# Altium schematic sheet 14_I2C_Sensor_OnBoard.SchDoc
size 420 x 297 mm; SheetNumber: 14; SheetTotal: 27
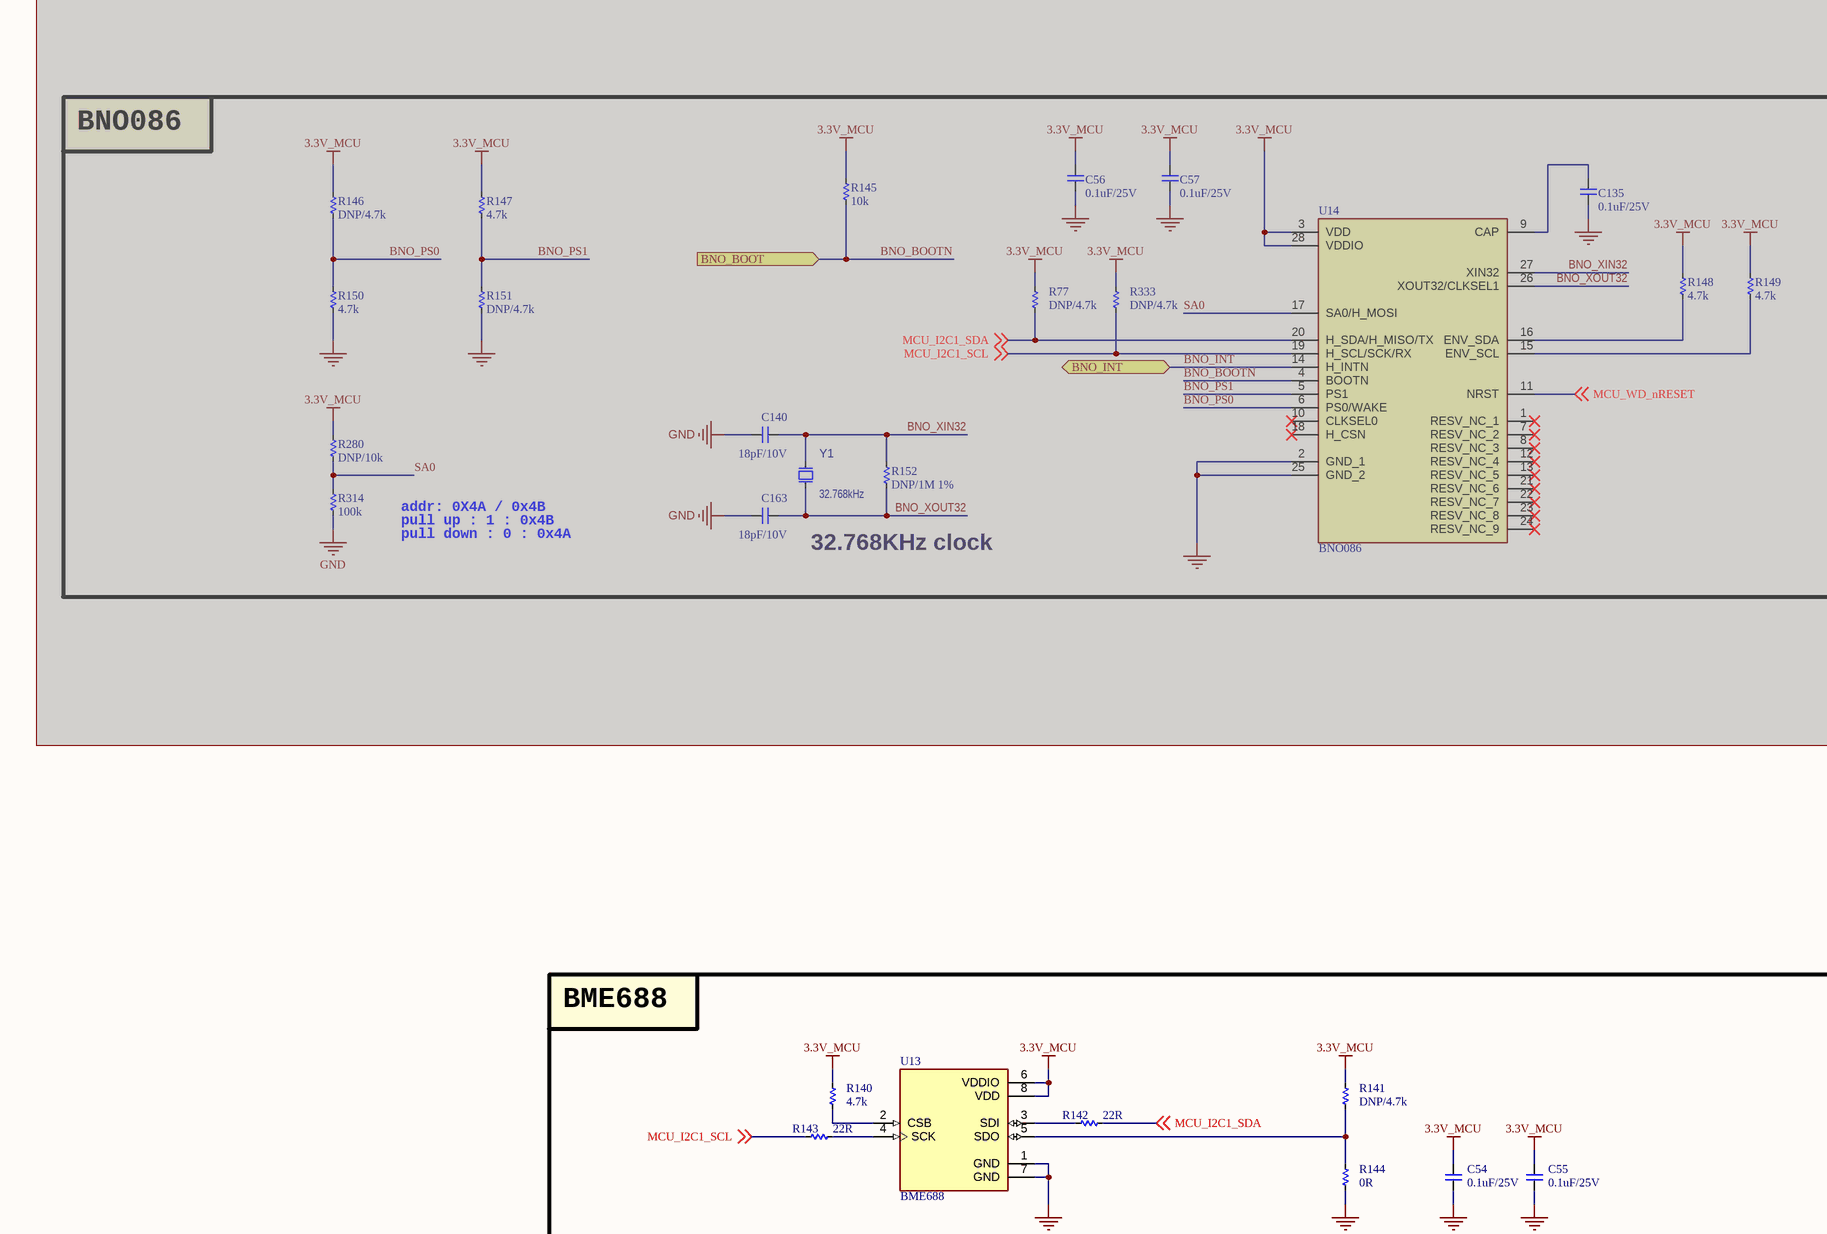
[diagram p0: 14_I2C_Sensor_OnBoard.SchDoc, top left]
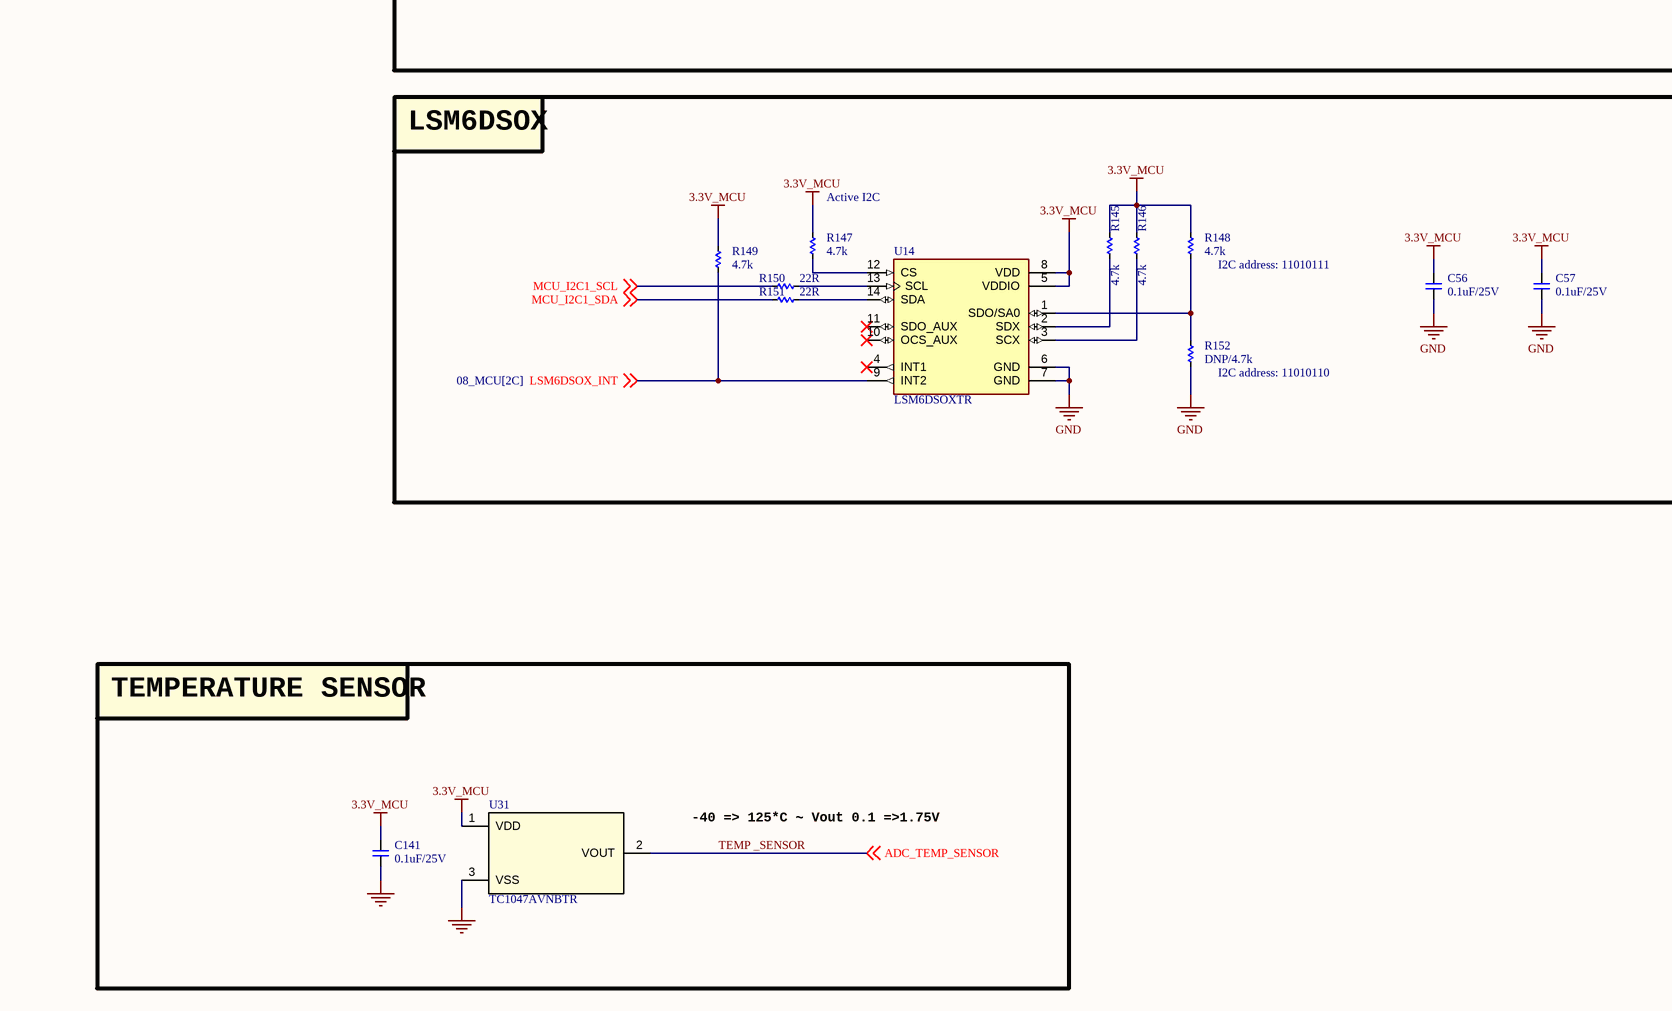
[diagram p1: 14_I2C_Sensor_OnBoard.SchDoc, bottom left]

## Parts
(Parts that share a designator on the sheet are numbered #1, #2 ... from top to bottom, then left to right.)
C54  0.1uF/25V  [CAP_C_1005X60]
C55  0.1uF/25V  [CAP_C_1005X60]
C56#1  0.1uF/25V  [CAP_C_1005X60]  (masked out: inside a compile mask, not in the netlist)
C56#2  0.1uF/25V  [CAP_C_1005X60]
C57#1  0.1uF/25V  [CAP_C_1005X60]  (masked out: inside a compile mask, not in the netlist)
C57#2  0.1uF/25V  [CAP_C_1005X60]
C135  0.1uF/25V  [CAP_C_1005X60]  (masked out: inside a compile mask, not in the netlist)
C140  18pF/10V  [CAP_C_1005X60]  (masked out: inside a compile mask, not in the netlist)
C141  0.1uF/25V  [CAP_C_1005X60]
C163  18pF/10V  [CAP_C_1005X60]  (masked out: inside a compile mask, not in the netlist)
R77  DNP/4.7k  [RES_C_1005X40]  (masked out: inside a compile mask, not in the netlist)
R140  4.7k  [RES_C_1005X40]
R141  DNP/4.7k  [RES_C_1005X40]
R142  22R  [RES_C_1005X40]
R143  22R  [RES_C_1005X40]
R144  0R  [RES_C_1005X40]
R145#1  10k  [RES_C_1005X40]  (masked out: inside a compile mask, not in the netlist)
R145#2  4.7k  [RES_C_1005X40]
R146#1  DNP/4.7k  [RES_C_1005X40]  (masked out: inside a compile mask, not in the netlist)
R146#2  4.7k  [RES_C_1005X40]
R147#1  4.7k  [RES_C_1005X40]  (masked out: inside a compile mask, not in the netlist)
R147#2  4.7k  [RES_C_1005X40]
R148#1  4.7k  [RES_C_1005X40]  (masked out: inside a compile mask, not in the netlist)
R148#2  4.7k  [RES_C_1005X40]
R149#1  4.7k  [RES_C_1005X40]  (masked out: inside a compile mask, not in the netlist)
R149#2  4.7k  [RES_C_1005X40]
R150#1  4.7k  [RES_C_1005X40]  (masked out: inside a compile mask, not in the netlist)
R150#2  22R  [RES_C_1005X40]
R151#1  DNP/4.7k  [RES_C_1005X40]  (masked out: inside a compile mask, not in the netlist)
R151#2  22R  [RES_C_1005X40]
R152#1  DNP/1M 1%  [RES_C_1005X40]  (masked out: inside a compile mask, not in the netlist)
R152#2  DNP/4.7k  [RES_C_1005X40]
R280  DNP/10k  [RES_C_1005X40]  (masked out: inside a compile mask, not in the netlist)
R314  100k  [RES_C_1005X40]  (masked out: inside a compile mask, not in the netlist)
R333  DNP/4.7k  [RES_C_1005X40]  (masked out: inside a compile mask, not in the netlist)
U13  BME688  [IC_BME688]
U14#1  BNO086  [BNO086]  (masked out: inside a compile mask, not in the netlist)
U14#2  LSM6DSOXTR  [PQFN50P250X300X86-14N]
U31  TC1047AVNBTR  [SOT95P240X120-3N]
Y1  value 32.768kHz  [CRYSTAL_NX2012SA]  (hidden comment: Crystal 2 Pins)  (masked out: inside a compile mask, not in the netlist)

## Blocks framed on the sheet
BNO086: C56#1 C57#1 C135 C140 C163 R77 R145#1 R146#1 R147#1 R148#1 R149#1 R150#1 R151#1 R152#1 R280 R314 R333 U14#1 Y1
BME688: C54 C55 R140-R144 U13
LSM6DSOX: C56#2 C57#2 R145#2 R146#2 R147#2 R148#2 R149#2 R150#2 R151#2 R152#2 U14#2
TEMPERATURE SENSOR: C141 U31

## Ports
BNO_BOOT (in), BNO_INT (bidir)

## Nets
3.3V_MCU: C54.2 C55.2 C56#2.2 C57#2.2 C141.2 R140.1 R141.1 R145#2.1 R146#2.1 R147#2.1 R148#2.1 R149#2.1 U13.6(VDDIO) U13.8(VDD) U14#2.5(VDDIO) U14#2.8(VDD) U31.1(VDD)
GND: C54.1 C55.1 C56#2.1 C57#2.1 C141.1 R144.2 R152#2.2 U13.1(GND) U13.7(GND) U14#2.6(GND) U14#2.7(GND) U31.3(VSS)
LSM6DSOX_INT: R149#2.2 U14#2.9(INT2) ; off-sheet LSM6DSOX_INT
MCU_I2C1_SCL: R143.1 R150#2.1 ; off-sheet MCU_I2C1_SCL
MCU_I2C1_SDA: R142.2 R151#2.1 ; off-sheet MCU_I2C1_SDA
TEMP _SENSOR: U31.2(VOUT) ; off-sheet ADC_TEMP_SENSOR  [also labelled ADC_TEMP_SENSOR]
NetR140_2: R140.2 U13.2(CSB)
NetR141_2: R141.2 R144.1 U13.5(SDO)
NetR142_1: R142.1 U13.3(SDI)
NetR143_2: R143.2 U13.4(SCK)
NetR145#2_2: R145#2.2 U14#2.2(SDX)
NetR146#2_2: R146#2.2 U14#2.3(SCX)
NetR147#2_2: R147#2.2 U14#2.12(CS)
NetR148#2_2: R148#2.2 R152#2.1 U14#2.1(SDO/SA0)
NetR150#2_2: R150#2.2 U14#2.13(SCL)
NetR151#2_2: R151#2.2 U14#2.14(SDA)

Not connected (* = marked no-connect by the designer): U14#2 4(INT1)* 10(OCS_AUX)* 11(SDO_AUX)*

## Notes on the sheet
- addr: 0X4A / 0x4B
- pull up : 1 : 0x4B
- pull down : 0 : 0x4A
- 32.768KHz clock
- (near R147#2) Active I2C
- (near R148#2) I2C address: 11010111
- (near R152#2) I2C address: 11010110
- -40 => 125*C ~ Vout 0.1 =>1.75V
- Project
- Sub-system:
- Design by:
- Sheet title:
- Sheet:
- of
- Checked by:
- Approved by:
- Doc no:
- Revision
- Size:
- Date:

## Library data of the parts
C54 C55 C56#1 C56#2 C57#1 C57#2 C135 C140 C141 C163 = _CAP_C_2: CAP
R77 R140-R144 R145#1 R145#2 R146#1 R146#2 R147#1 R147#2 R148#1 R148#2 R149#1 R149#2 R150#1 R150#2 R151#1 R151#2 R152#1 R152#2 R280 R314 R333 = _RES_B_2: RES
U13 = BME688: Gas sensor measuring relative humidity, barometric pressure, ambient temperature and gas (VOC); Package: None; MP: BME688; Price: None; Availability: Unavailable; Value: *
U14#1 = BNO086: Accelerometer, Gyroscope, Magnetometer, Temperature, 9 Axis Sensor IC, SPI Output; Manufacturer_Name: CEVA; Geometry.Height: 1.18mm; Mouser Part Number: 526-BNO086; Mouser Price/Stock: https://www.mouser.co.uk/ProductDetail/CEVA/BNO086?qs=ulEaXIWI0c%2FqTo1scjodAw%3D%3D; Manufacturer_Part_Number: BNO086; Datasheet Link: *
U14#2 = LSM6DSOXTR: Accelerometer, Gyroscope, 6 Axis Sensor I2C, SPI Output; MF: STMicroelectronics; SnapEDA_Link: https://www.snapeda.com/parts/LSM6DSOXTR/STMicroelectronics/view-part/?ref=snap; Package: VFLGA-14 STMicroelectronics; Value: *; MP: LSM6DSOXTR; Check_prices: https://www.snapeda.com/parts/LSM6DSOXTR/STMicroelectronics/view-part/?ref=eda
U31 = IC_SENSOR_TC1047AVNBTR: Temperature Sensor Analog, Local -40°C ~ 125°C 10mV/°C SOT-23-3
Y1 = OSC_32.768kHz: Crystal; Manufacturer 1: NDK; Manufacturer Part Number 1: NX2012SA-32.768K-STD-MUB-1; MCHP-ID: OSC1092; Description_: CRYSTAL 32.768kHz 12.5pF SMD NX2012SA; Dev Tools Status: Production; Owner: Jamus Griego; Tolerance: ±20ppm; Load Capacitance: 12.5pF; Populated: YES; Revision: 1; Symbol: Crystal 2 Pins; Status: MCL Design; ComponentLink1URL: https://chn-vm-apps.microchip.com/mchprepo/parts/Datasheets/c_NX2012SA-STD-MUB-1_e.pdf; ComponentLink1Description: SVN Datasheet; ComponentLink2URL: C:\ALTIUM_WORK\00001_MCHP-CDB\Datasheets\c_NX2012SA-STD-MUB-1_e.pdf; ComponentLink2Description: Local Datasheet; ComponentLink3URL: C:\ALTIUM_WORK\00001_MCHP-CDB\Library\LibraryRefs\Crystal 2 Pins.SchLib; ComponentLink3Description: Open Symbol; ComponentLink4URL: C:\ALTIUM_WORK\00001_MCHP-CDB\Library\Footprints\CRYSTAL_NX2012SA.PcbLib; ComponentLink4Description: Open Footprint; ComponentLink5Description: Open Footprint 2; ComponentLink6Description: Open Footprint 3; ComponentLink7Description: Open Footprint 4; Type: Crystal; Category: Crystal/Oscillator; Supplier 1: Digi-Key; Supplier Part Number 1: 644-1219-1-ND; Quantity Override: 1